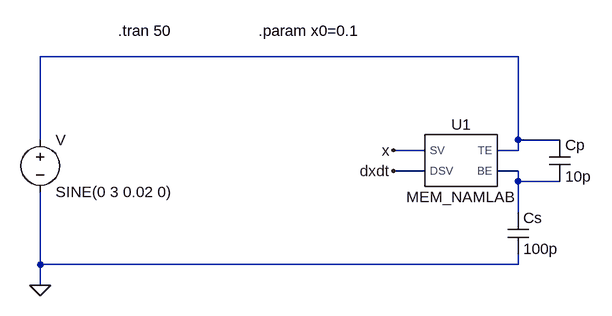
[diagram p0: schematic mem_cap.asc]
mem_cap.asc, the LTspice schematic file:
Version 4
SHEET 1 1352 680
WIRE 528 -160 -208 -160
WIRE -208 -32 -208 -160
WIRE 528 -32 528 -160
WIRE 592 -32 528 -32
WIRE 384 -16 336 -16
WIRE 528 -16 528 -32
WIRE 528 -16 496 -16
WIRE 384 16 336 16
WIRE 528 16 496 16
WIRE 528 32 528 16
WIRE 592 32 528 32
WIRE 528 80 528 32
WIRE -208 160 -208 48
WIRE 528 160 528 144
WIRE 528 160 -208 160
WIRE -208 192 -208 160
FLAG -208 192 0
FLAG 336 -16 x
FLAG 336 16 dxdt
SYMBOL voltage -208 -48 R0
WINDOW 123 0 0 Left 0
WINDOW 39 0 0 Left 0
SYMATTR InstName V
SYMATTR Value SINE(0 3 0.02 0)
SYMBOL Mem 432 0 R0
SYMATTR InstName U1
SYMBOL cap 512 80 R0
SYMATTR InstName Cs
SYMATTR Value 100p
SYMBOL cap 576 -32 R0
SYMATTR InstName Cp
SYMATTR Value 10p
TEXT -88 -200 Left 2 !.tran 50
TEXT 128 -200 Left 2 !.param x0=0.1

The netlist it stands for:
* mem_cap.asc
V N001 0 SINE(0 3 0.02 0)
XU1 N001 N002 x dxdt MEM_NAMLAB  ; pins TE BE SV DSV
Cs N002 0 100p
Cp N001 N002 10p
.tran 50
.param x0=0.1
.lib C:\Users\NAGARAJ V REDDY\Documents\NES\1SEM\NNMHA\Neuro-transistor-Simulation-with-Memristor-based-Memcapacitor-using-LTSPICE\src\base\MEM_NAMLAB.cir
.backanno
.end